# Altium schematic sheet 11_Power.SchDoc: Power (part 1 of 3)
size A3; Organization: Lime Microsystems; Address1: Surrey Tech Centre; Address2: Guildford GU2 7YG; Address3: Surrey; Address4: United Kingdom; Revision: v1.0; SheetNumber: 11; SheetTotal: 11
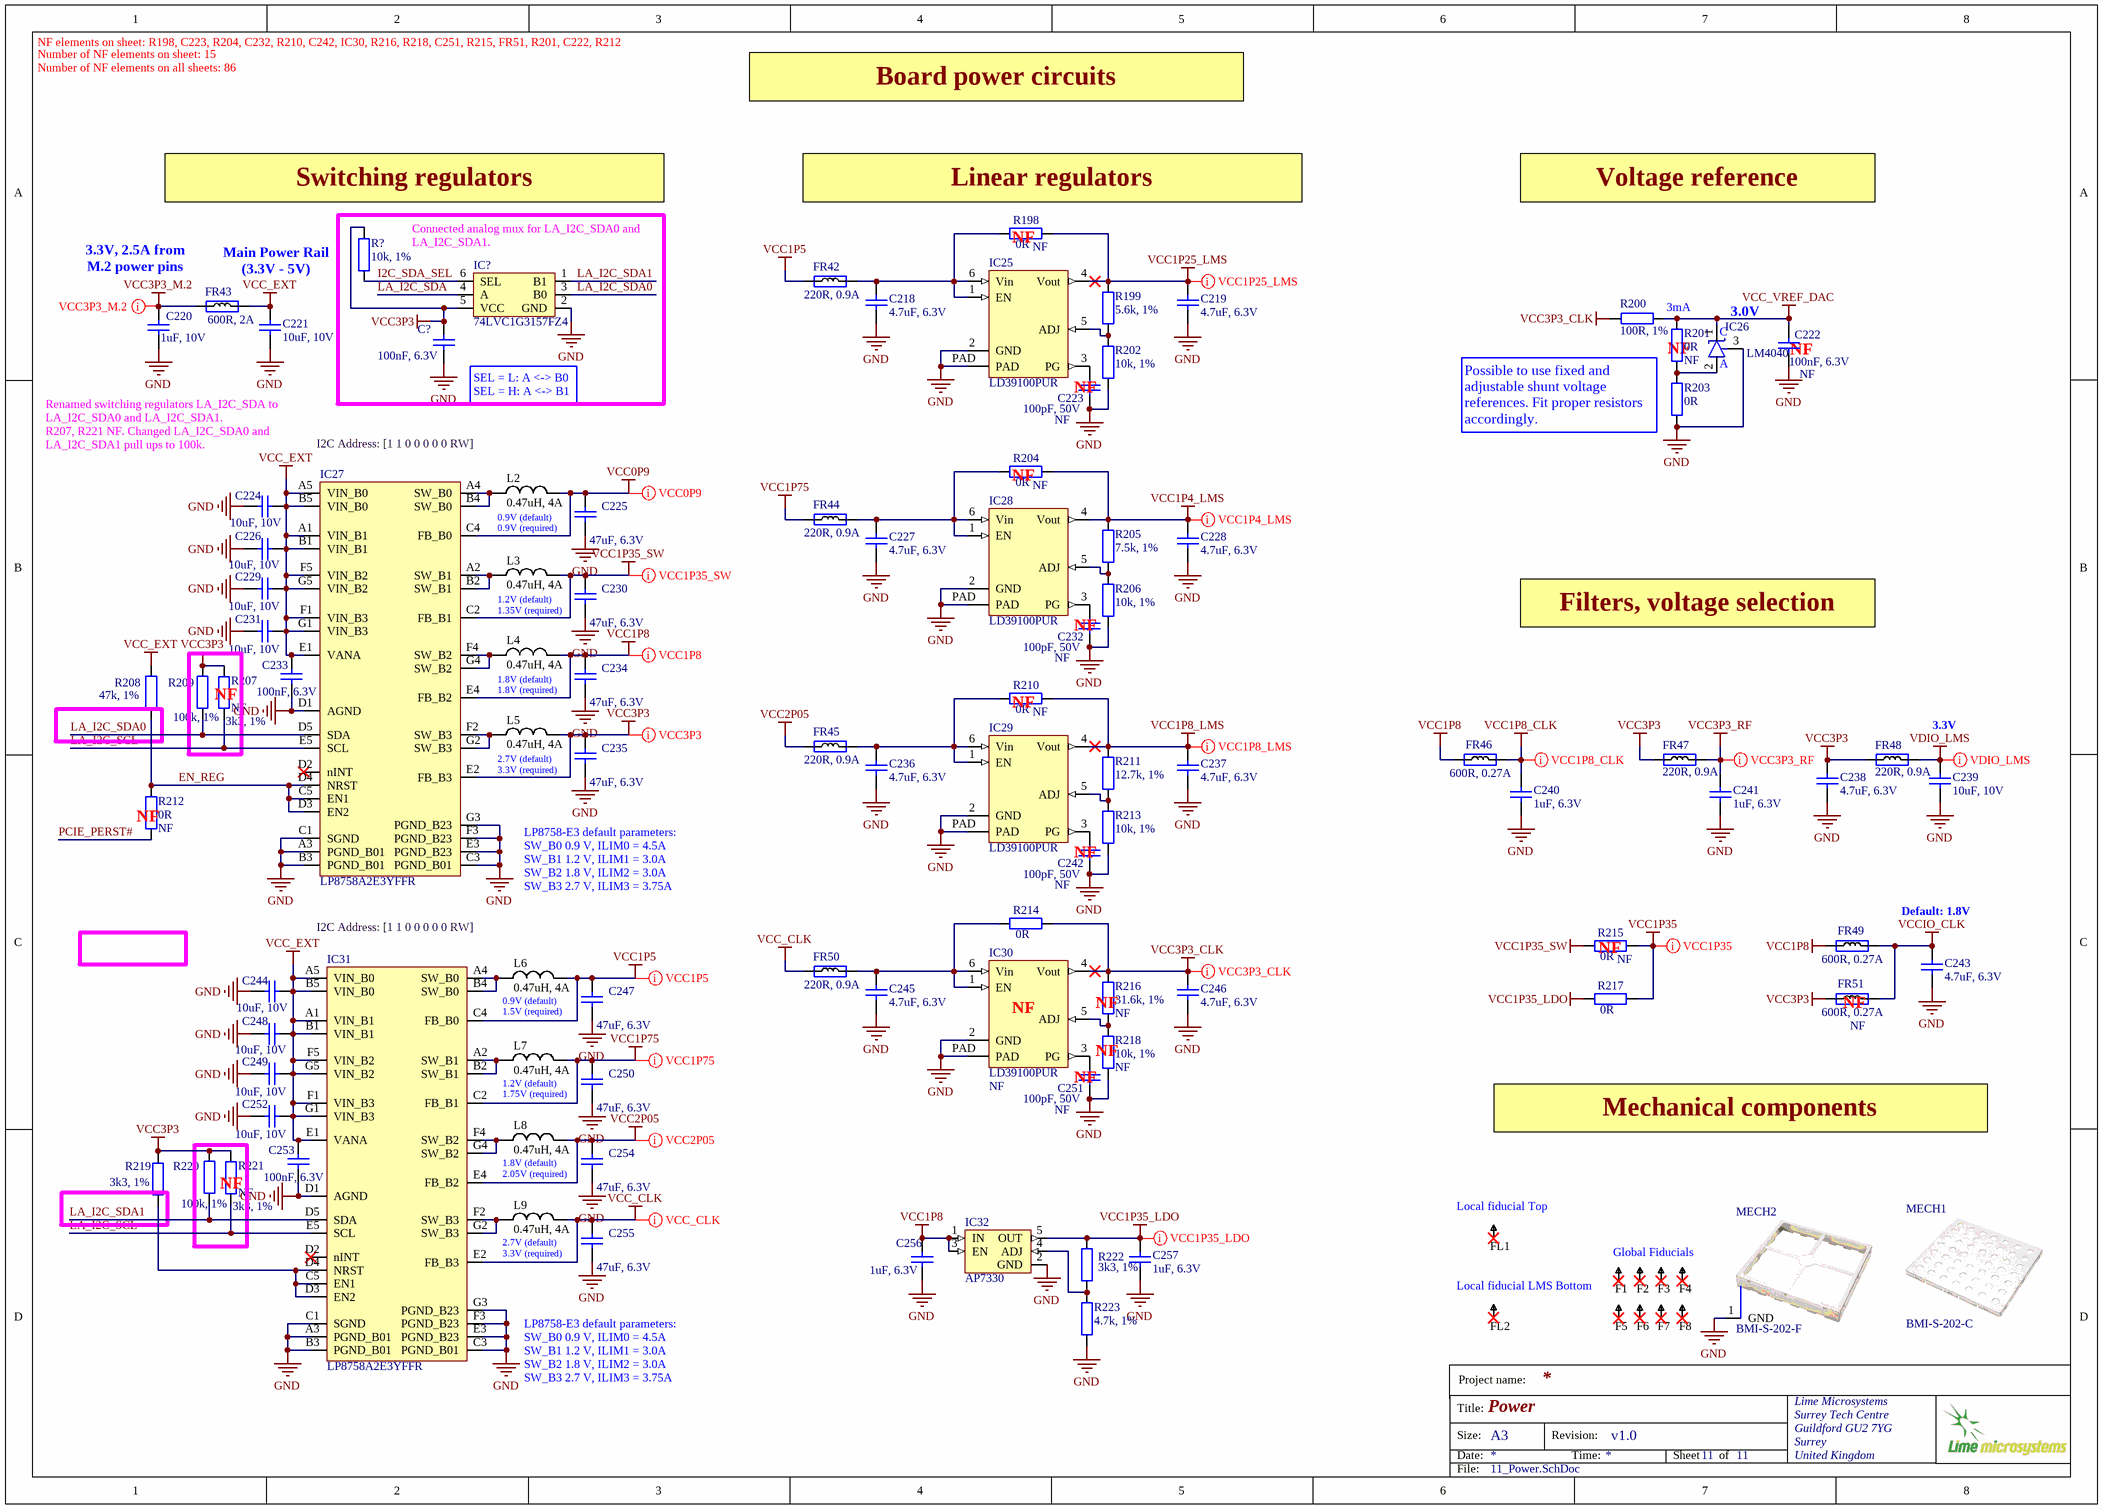
[diagram p0: 11_Power.SchDoc]

## Parts
C218  4.7uF, 6.3V  [CAP0402]
C219  4.7uF, 6.3V  [CAP0402]
C220  1uF, 10V  [CAP0402]
C221  10uF, 10V  [CAP0603]
C222  100nF, 6.3V  Assembly Info: NF  [CAP0201]
C223  100pF, 50V  Assembly Info: NF  [CAP0201]
C224  10uF, 10V  [CAP0603]
C225  47uF, 6.3V  [CAP0603]
C226  10uF, 10V  [CAP0603]
C227  4.7uF, 6.3V  [CAP0402]
C228  4.7uF, 6.3V  [CAP0402]
C229  10uF, 10V  [CAP0603]
C230  47uF, 6.3V  [CAP0603]
C231  10uF, 10V  [CAP0603]
C232  100pF, 50V  Assembly Info: NF  [CAP0201]
C233  100nF, 6.3V  [CAP0201]
C234  47uF, 6.3V  [CAP0603]
C235  47uF, 6.3V  [CAP0603]
C236  4.7uF, 6.3V  [CAP0402]
C237  4.7uF, 6.3V  [CAP0402]
C238  4.7uF, 6.3V  [CAP0402]
C239  10uF, 10V  [CAP0603]
C240  1uF, 6.3V  [CAP0201]
C241  1uF, 6.3V  [CAP0201]
C242  100pF, 50V  Assembly Info: NF  [CAP0201]
C243  4.7uF, 6.3V  [CAP0402]
C244  10uF, 10V  [CAP0603]
C245  4.7uF, 6.3V  [CAP0402]
C246  4.7uF, 6.3V  [CAP0402]
C247  47uF, 6.3V  [CAP0603]
C248  10uF, 10V  [CAP0603]
C249  10uF, 10V  [CAP0603]
C250  47uF, 6.3V  [CAP0603]
C251  100pF, 50V  Assembly Info: NF  [CAP0201]
C252  10uF, 10V  [CAP0603]
C253  100nF, 6.3V  [CAP0201]
C254  47uF, 6.3V  [CAP0603]
C255  47uF, 6.3V  [CAP0603]
C256  1uF, 6.3V  [CAP0201]
C257  1uF, 6.3V  [CAP0201]
C?  100nF, 6.3V  [CAP0201]
F1  Fiducial  [Fiducial]  (value not drawn)
F2  Fiducial  [Fiducial]  (value not drawn)
F3  Fiducial  [Fiducial]  (value not drawn)
F4  Fiducial  [Fiducial]  (value not drawn)
F5  Fiducial  [Fiducial]  (value not drawn)
F6  Fiducial  [Fiducial]  (value not drawn)
F7  Fiducial  [Fiducial]  (value not drawn)
F8  Fiducial  [Fiducial]  (value not drawn)
FL1  Fiducial  [Fiducial_local]  (value not drawn)
FL2  Fiducial  [Fiducial_local]  (value not drawn)
FR42  220R, 0.9A  [RES0402]
FR43  600R, 2A  [RES0805]
FR44  220R, 0.9A  [RES0402]
FR45  220R, 0.9A  [RES0402]
FR46  600R, 0.27A  [RES0201]
FR47  220R, 0.9A  [RES0402]
FR48  220R, 0.9A  [RES0402]
FR49  600R, 0.27A  [RES0201]
FR50  220R, 0.9A  [RES0402]
FR51  Assembly Info: NF  [RES0201]  (hidden comment: 600R, 0.27A)
IC25  LD39100PUR  [LD39100PUR]
IC26  LM4040  [SOT23-3_v3]
IC27  LP8758A2E3YFFR  [LP8758A1E0YFFR_QUAD_DC-DC_35DSBGA]
IC28  LD39100PUR  [LD39100PUR]
IC29  LD39100PUR  [LD39100PUR]
IC30  LD39100PUR  Assembly Info: NF  [LD39100PUR]
IC31  LP8758A2E3YFFR  [LP8758A1E0YFFR_QUAD_DC-DC_35DSBGA]
IC32  AP7330  [AP7330-W5-7_SOT25]
IC?  74LVC1G3157FZ4  [74LVC1G3157FZ4_SPDT_SW_DFN1410-6]
L2  0.47uH, 4A  [IND0806]
L3  0.47uH, 4A  [IND0806]
L4  0.47uH, 4A  [IND0806]
L5  0.47uH, 4A  [IND0806]
L6  0.47uH, 4A  [IND0806]
L7  0.47uH, 4A  [IND0806]
L8  0.47uH, 4A  [IND0806]
L9  0.47uH, 4A  [IND0806]
MECH1  BMI-S-202-C  [BMI-S-202-C_RF_SHIELD_COVER]
MECH2  BMI-S-202-F  [BMI-S-202-F_RF_SHIELD_FRAME_v3]
R198  0R  Assembly Info: NF  [RES0201]
R199  5.6k, 1%  [RES0201]
R200  100R, 1%  [RES0201]
R201  0R  Assembly Info: NF  [RES0201]
R202  10k, 1%  [RES0201]
R203  0R  [RES0201]
R204  0R  Assembly Info: NF  [RES0201]
R205  7.5k, 1%  [RES0201]
R206  10k, 1%  [RES0201]
R207  3k3, 1%  Assembly Info: NF  [RES0201]
R208  47k, 1%  [RES0201]
R209  100k, 1%  [RES0201]
R210  0R  Assembly Info: NF  [RES0201]
R211  12.7k, 1%  [RES0201]
R212  0R  Assembly Info: NF  [RES0201]
R213  10k, 1%  [RES0201]
R214  0R  [RES0201]
R215  0R  Assembly Info: NF  [RES0201]
R216  31.6k, 1%  Assembly Info: NF  [RES0201]
R217  0R  [RES0201]
R218  10k, 1%  Assembly Info: NF  [RES0201]
R219  3k3, 1%  [RES0201]
R220  100k, 1%  [RES0201]
R221  3k3, 1%  Assembly Info: NF  [RES0201]
R222  3k3, 1%  [RES0201]
R223  4.7k, 1%  [RES0201]
R?  10k, 1%  [RES0201]

## Nets
GND: C218.1 C219.1 C220.1 C221.1 C222.2 C223.1 C224.1 C225.1 C226.1 C227.1 C228.1 C229.1 C230.1 C231.1 C232.1 C233.2 C234.1 C235.1 C236.1 C237.1 C238.1 C239.1 C240.2 C241.2 C242.1 C243.1 C244.1 C245.1 C246.1 C247.1 C248.1 C249.1 C250.1 C251.1 C252.1 C253.2 C254.1 C255.1 C256.2 C257.2 C?.2 IC25.2(GND) IC25.PAD IC26.3(NC/A) IC27.A3(PGND_B01) IC27.B3(PGND_B01) IC27.C1(SGND) IC27.C3(PGND_B01) IC27.D1(AGND) IC27.E3(PGND_B23) IC27.F3(PGND_B23) IC27.G3(PGND_B23) IC28.2(GND) IC28.PAD IC29.2(GND) IC29.PAD IC30.2(GND) IC30.PAD IC31.A3(PGND_B01) IC31.B3(PGND_B01) IC31.C1(SGND) IC31.C3(PGND_B01) IC31.D1(AGND) IC31.E3(PGND_B23) IC31.F3(PGND_B23) IC31.G3(PGND_B23) IC32.2(GND) IC?.2(GND) MECH2.1(GND) R202.2 R203.2 R206.2 R213.2 R218.2 R223.2
VCC0P9: C225.2 IC27.C4(FB_B0) L2.2
VCC1P4_LMS: C228.2 IC28.4(Vout) R204.2 R205.1
VCC1P5: C247.2 FR42.1 IC31.C4(FB_B0) L6.2
VCC1P8: C234.2 C256.1 FR46.1 FR49.1 IC27.E4(FB_B2) IC32.1(IN) IC32.3(EN) L4.2
VCC1P8_CLK: C240.1 FR46.2
VCC1P8_LMS: C237.2 IC29.4(Vout) R210.2 R211.1
VCC1P25_LMS: C219.2 IC25.4(Vout) R198.2 R199.1
VCC1P35: R215.2 R217.2
VCC1P35_LDO: C257.1 IC32.5(OUT) R217.1 R222.1
VCC1P35_SW: C230.2 IC27.C2(FB_B1) L3.2 R215.1
VCC1P75: C250.2 FR44.1 IC31.C2(FB_B1) L7.2
VCC2P05: C254.2 FR45.1 IC31.E4(FB_B2) L8.2
VCC3P3: C235.2 C238.2 C?.1 FR47.1 FR48.1 FR51.1 IC27.E2(FB_B3) IC?.5(VCC) L5.2 R207.1 R209.1 R219.1 R220.1 R221.1 R?.2
VCC3P3_CLK: C246.2 IC30.4(Vout) R200.2 R214.2 R216.1
VCC3P3_M.2: C220.2 FR43.1
VCC3P3_RF: C241.1 FR47.2
VCC_CLK: C255.2 FR50.1 IC31.E2(FB_B3) L9.2
VCC_EXT: C221.2 C224.2 C226.2 C229.2 C231.2 C233.1 C244.2 C248.2 C249.2 C252.2 C253.1 FR43.2 IC27.A1(VIN_B1) IC27.A5(VIN_B0) IC27.B1(VIN_B1) IC27.B5(VIN_B0) IC27.E1(VANA) IC27.F1(VIN_B3) IC27.F5(VIN_B2) IC27.G1(VIN_B3) IC27.G5(VIN_B2) IC31.A1(VIN_B1) IC31.A5(VIN_B0) IC31.B1(VIN_B1) IC31.B5(VIN_B0) IC31.E1(VANA) IC31.F1(VIN_B3) IC31.F5(VIN_B2) IC31.G1(VIN_B3) IC31.G5(VIN_B2) R208.1
VCC_VREF_DAC: C222.1 IC26.1(K) R200.1 R201.1
VCCIO_CLK: C243.2 FR49.2 FR51.2
VDIO_LMS: C239.2 FR48.2
EN_REG: IC27.C5(EN1) IC27.D3(EN2) IC27.D4(NRST) R208.2 R212.2
I2C_SDA_SEL: IC?.6(SEL) R?.1
LA_I2C_SCL: IC27.E5(SCL) IC31.E5(SCL) R207.2 R221.2
LA_I2C_SDA: IC?.4(A)
LA_I2C_SDA0: IC27.D5(SDA) IC?.3(B0) R209.2
LA_I2C_SDA1: IC31.D5(SDA) IC?.1(B1) R220.2
PCIE_PERST#: R212.1
NetC218_2: C218.2 FR42.2 IC25.1(EN) IC25.6(Vin) R198.1
NetC223_2: C223.2 IC25.3(PG)
NetC227_2: C227.2 FR44.2 IC28.1(EN) IC28.6(Vin) R204.1
NetC232_2: C232.2 IC28.3(PG)
NetC236_2: C236.2 FR45.2 IC29.1(EN) IC29.6(Vin) R210.1
NetC242_2: C242.2 IC29.3(PG)
NetC245_2: C245.2 FR50.2 IC30.1(EN) IC30.6(Vin) R214.1
NetC251_2: C251.2 IC30.3(PG)
NetIC25_5: IC25.5(ADJ) R199.2 R202.1
NetIC26_2: IC26.2(A) R201.2 R203.1
NetIC27_A2: IC27.A2(SW_B1) IC27.B2(SW_B1) L3.1
NetIC27_A4: IC27.A4(SW_B0) IC27.B4(SW_B0) L2.1
NetIC27_F2: IC27.F2(SW_B3) IC27.G2(SW_B3) L5.1
NetIC27_F4: IC27.F4(SW_B2) IC27.G4(SW_B2) L4.1
NetIC28_5: IC28.5(ADJ) R205.2 R206.1
NetIC29_5: IC29.5(ADJ) R211.2 R213.1
NetIC30_5: IC30.5(ADJ) R216.2 R218.1
NetIC31_A2: IC31.A2(SW_B1) IC31.B2(SW_B1) L7.1
NetIC31_A4: IC31.A4(SW_B0) IC31.B4(SW_B0) L6.1
NetIC31_C5: IC31.C5(EN1) IC31.D3(EN2) IC31.D4(NRST) R219.2
NetIC31_F2: IC31.F2(SW_B3) IC31.G2(SW_B3) L9.1
NetIC31_F4: IC31.F4(SW_B2) IC31.G4(SW_B2) L8.1
NetIC32_4: IC32.4(ADJ) R222.2 R223.1

Not connected (* = marked no-connect by the designer): F1 1*; F2 1*; F3 1*; F4 1*; F5 1*; F6 1*; F7 1*; F8 1*; FL1 1*; FL2 1*; IC27 D2(nINT)*; IC31 D2(nINT)*

## Layout directives
net class VCC1P25_LMS: VCC1P25_LMS
net class VCC1P4_LMS: VCC1P4_LMS
net class VCC1P8_LMS: VCC1P8_LMS
net class VCC3P3_CLK: VCC3P3_CLK
net class VCC1P5: VCC1P5
net class VCC0P9: VCC0P9
net class VCC1P35_SW: VCC1P35_SW
net class VCC1P8: VCC1P8
net class VCC3P3: VCC3P3
net class VCC1P75: VCC1P75
net class VCC2P5: VCC2P05
net class VCC_CLK: VCC_CLK
net class VCC1P35_LDO: VCC1P35_LDO
net class VDIO_LMS: VDIO_LMS
net class VCC1P35: VCC1P35
net class VCC3P3_RF: VCC3P3_RF
net class VCC1P8_CLK: VCC1P8_CLK
net class VCC3P3_M.2: VCC3P3_M.2

## Notes on the sheet
- NF elements on sheet: R198, C223, R204, C232, R210, C242, IC30, R216, R218, C251, R215, FR51, R201, C222, R212
- Number of NF elements on sheet: 15
- Number of NF elements on all sheets: 86
- Board power circuits
- (near R?) Switching regulators
- (near R198) Linear regulators
- (near R198) NF
- Voltage reference
- 3.3V, 2.5A from M.2 power pins
- Main Power Rail
  (3.3V - 5V)
- (near IC?) Connected analog mux for LA_I2C_SDA0 and LA_I2C_SDA1.
- 3mA
- 3.0V
- (near R201) NF
- (near IC26) A
- (near IC26) C
- (near C222) NF
- Renamed switching regulators LA_I2C_SDA to LA_I2C_SDA0 and LA_I2C_SDA1.
  R207, R221 NF. Changed LA_I2C_SDA0 and LA_I2C_SDA1 pull ups to 100k.
- I2C Address: [1 1 0 0 0 0 0 RW]
- (near C?) SEL = L: A <-> B0
  SEL = H: A <-> B1
- NF
- Possible to use fixed and adjustable shunt voltage references. Fit proper resistors accordingly.
- (near R204) NF
- 0.9V (default)
  0.9V (required)
- 1.2V (default)
  1.35V (required)
- Filters, voltage selection
- 1.8V (default)
  1.8V (required)
- (near R210) NF
- 2.7V (default)
  3.3V (required)
- 3.3V
- (near R212) NF
- LP8758-E3 default parameters:
  SW_B0 0.9 V, ILIM0 = 4.5A
  SW_B1 1.2 V, ILIM1 = 3.0A
  SW_B2 1.8 V, ILIM2 = 3.0A
  SW_B3 2.7 V, ILIM3 = 3.75A
- Default: 1.8V
- (near R215) NF
- 0.9V (default)
  1.5V (required)
- (near IC30) NF
- (near R218) NF
- (near R216) NF
- (near FR51) NF
- 1.2V (default)
  1.75V (required)
- Mechanical components
- 1.8V (default)
  2.05V (required)
- (near FL1) Local fiducial Top
- Global Fiducials
- Local fiducial LMS Bottom
- Project name:
- Title:
- Size:
- Date:
- A3
- Revision:
- Time:
- Sheet
- of
- File: